# EAGLE design vacuum-controller-rev-a (EAGLE 7.3.0)
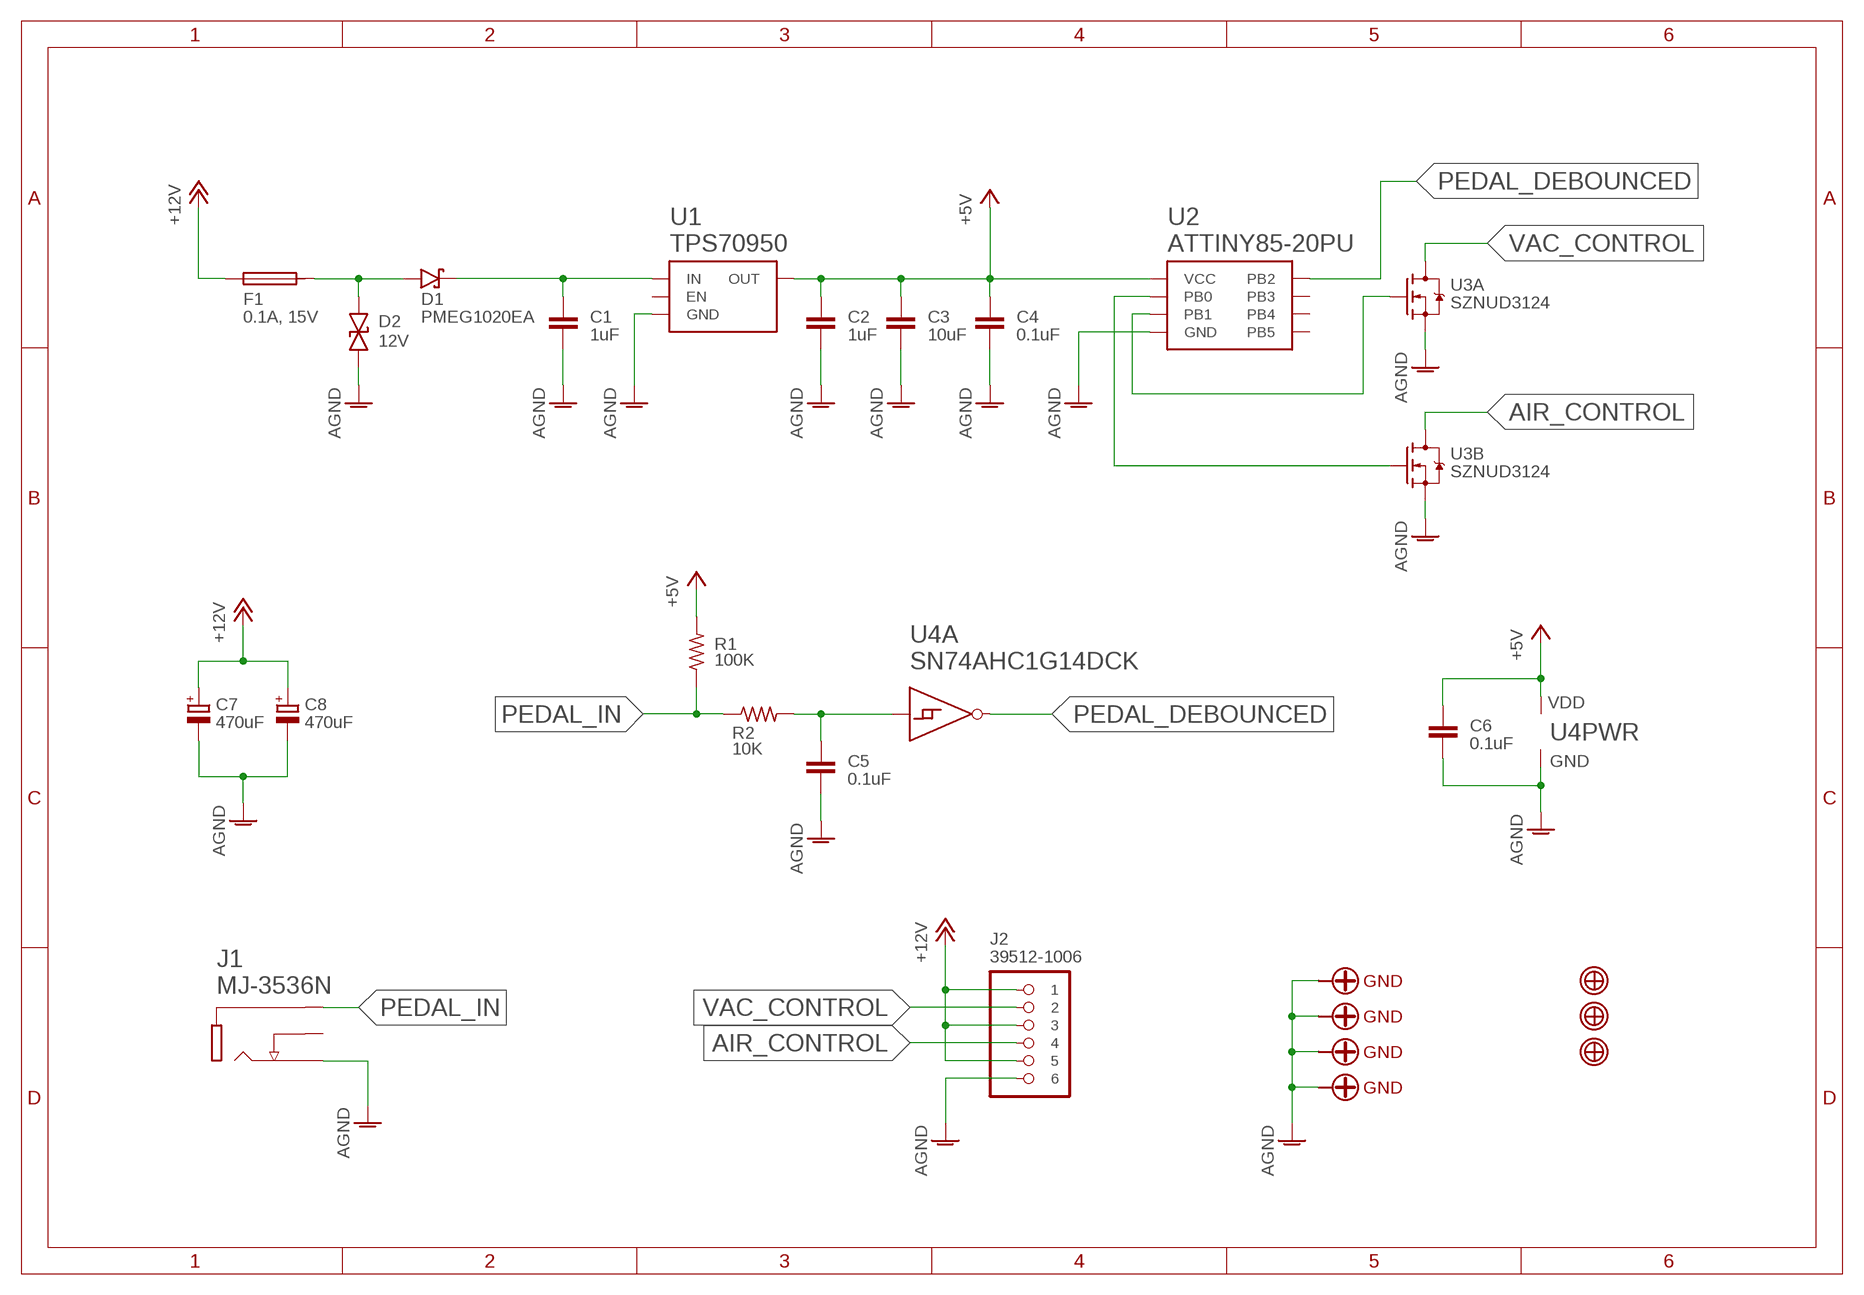
[diagram p0: schematic, sheet 1]

## Parts
C1  1uF  CAPACITOR-0603  [C0603]
C2  1uF  CAPACITOR-0603  [C0603]
C3  10uF  CAPACITOR-0805  [C0805]
C4  0.1uF  CAPACITOR-0402  [C0402]
C5  0.1uF  CAPACITOR-0402  [C0402]
C6  0.1uF  CAPACITOR-0402  [C0402]
C7  470uF  CAPACITOR-POLARIZED-RADIAL-D8-P3.5-PD0.5  [RADIAL-D8-P3.5-PD0.5]
C8  470uF  CAPACITOR-POLARIZED-RADIAL-D8-P3.5-PD0.5  [RADIAL-D8-P3.5-PD0.5]
D1  PMEG1020EA  [SOD323-R]
D2  12V  SUPPRESSOR-DUAL-SMA  [SMA]
F1  0.1A, 15V  FUSE-HORIZONTAL-0805  [C0805]
J1  MJ-3536N  [MJ-3536N]
J2  39512-1006  [39512-1006]
R1  100K  RESISTOR-0402  [R0402]
R2  10K  RESISTOR-HORIZONTAL-0402  [R0402]
U1  TPS70950  TPS709  [R-PDSO-G5-DBV]
U2  ATTINY85-20PU  [PDIP-8]
U3  SZNUD3124  [SOT-457]
U4  SN74AHC1G14DCK  [R-PDSO-G5-DCK]
U$1  SCREW-THRU-GND-#4  [SCREW-THRU-GND-#4]
U$2  SCREW-THRU-GND-#4  [SCREW-THRU-GND-#4]
U$3  SCREW-THRU-GND-#4  [SCREW-THRU-GND-#4]
U$4  SCREW-THRU-GND-#4  [SCREW-THRU-GND-#4]
U$5  FIDUCIAL-1MM  [FIDUCIAL_1MM]
U$6  FIDUCIAL-1MM  [FIDUCIAL_1MM]
U$7  FIDUCIAL-1MM  [FIDUCIAL_1MM]

## Nets
+5V: C2.1 C3.1 C4.1 C6.1 R1.2 U1.5(OUT) U2.P$8(VCC) U4.5(PWR:VDD)
+12V: C7.+ C8.+ F1.1 J2.P$1 J2.P$3 J2.P$5
AGND: C1.2 C2.2 C3.2 C4.2 C5.2 C6.2 C7.- C8.- D2.A J1.P$2 J2.P$6 U1.2(GND) U2.P$4(GND) U3.1(A:S) U3.4(B:S) U4.3(PWR:GND) U$1.P$1(GND) U$1.P$2(GND) U$1.P$3(GND) U$1.P$4(GND) U$1.P$5(GND) U$1.P$6(GND) U$1.P$7(GND) U$1.P$8(GND) U$1.P$9(GND) U$2.P$1(GND) U$2.P$2(GND) U$2.P$3(GND) U$2.P$4(GND) U$2.P$5(GND) U$2.P$6(GND) U$2.P$7(GND) U$2.P$8(GND) U$2.P$9(GND) U$3.P$1(GND) U$3.P$2(GND) U$3.P$3(GND) U$3.P$4(GND) U$3.P$5(GND) U$3.P$6(GND) U$3.P$7(GND) U$3.P$8(GND) U$3.P$9(GND) U$4.P$1(GND) U$4.P$2(GND) U$4.P$3(GND) U$4.P$4(GND) U$4.P$5(GND) U$4.P$6(GND) U$4.P$7(GND) U$4.P$8(GND) U$4.P$9(GND)
AIR_CONTROL: J2.P$4 U3.3(B:D)
N$1: C1.1 D1.C U1.1(IN)
N$2: D1.A D2.C F1.2
N$3: C5.1 R2.2 U4.2(A:A)
N$4: U2.P$6(PB1) U3.2(A:G)
N$6: U2.P$5(PB0) U3.5(B:G)
PEDAL_DEBOUNCED: U2.P$7(PB2) U4.4(A:Y)
PEDAL_IN: J1.P$1 R1.1 R2.1
VAC_CONTROL: J2.P$2 U3.6(A:D)
Unconnected: J1.P$3 U1.3(EN) U2.P$1(PB5) U2.P$2(PB3) U2.P$3(PB4)

## Library data of the parts
C1 C2 = passives:CAPACITOR: Capacitor; PN: GRM188R61E105KA12D
C3 = passives:CAPACITOR: Capacitor; PN: GRM21BR61A106KE19L
C4-C6 = passives:CAPACITOR: Capacitor; PN: GRM155R71H104KE14D
C7 = passives:CAPACITOR-POLARIZED: POLARIZED CAPACITOR, European symbol; PN: 860020474014
C8 = passives:CAPACITOR-POLARIZED: POLARIZED CAPACITOR, European symbol
D1 = nxp:PMEG1020EA: 2A ultra low Vf MEGA Schottky barrier rectiﬁer Planar Maximum Efﬁciency General Application (MEGA) Schottky barrier rectiﬁer with an integrated guard ring for stress protection, encapsulated in SOD323 (SC-76) very small Surface-Mounted Device (SMD) plastic package.; PN: PMEG1020EA,115
D2 = diodes:SUPPRESSOR-DUAL-; PN: SMAJ12CA-13-F
F1 = passives:FUSE-HORIZONTAL; PN: 0ZCK0010FF2G
J1 = cui:MJ-3536N; PN: MJ-3536N
J2 = molex:39512-1006: 3.81mm Pitch Eurostyle™ Horizontal PCB Header, 6 Circuits; MATES: 39510-0006; PN: 39512-1006
R1 = passives:RESISTOR; PN: RC0402FR-07100KL
R2 = passives:RESISTOR-HORIZONTAL; PN: RC0402FR-0710KL
U1 = texas-instruments:TPS709: 150-mA, 30-V, 1-µA Iq Voltage Regulators with Enable; PN: TPS70950DBVR
U2 = atmel:ATTINY: Atmel 8-bit AVR Microcontroller with 2/4/8K Bytes In-System Programmable Flash; PN: ATtiny85-20SU
U3 = on-semiconductor:SZNUD3124: Automotive Inductive Load Driver (two channel) This micro−integrated part provides a single component solution to switch inductive loads such as relays, solenoids, and small DC motors without the need of a free−wheeling diode. It accepts logic level inputs, thus allowing it to be driven by a large variety of devices including logic gates, inverters, and microcontrollers.; PN: SZNUD3124DMT1G
U4 = texas-instruments:SN74AHC1G14: Single Schmitt-Trigger Inverter Gate; PN: SN74AHC1G14DCKR
U$1-U$4 = screws:SCREW-THRU-GND; BOM: EXCLUDE
U$5-U$7 = fiducials:FIDUCIAL: Fidicual Mark Used by pick-and-place machines to align and orient boards before loading components.; BOM: EXCLUDE

## Board
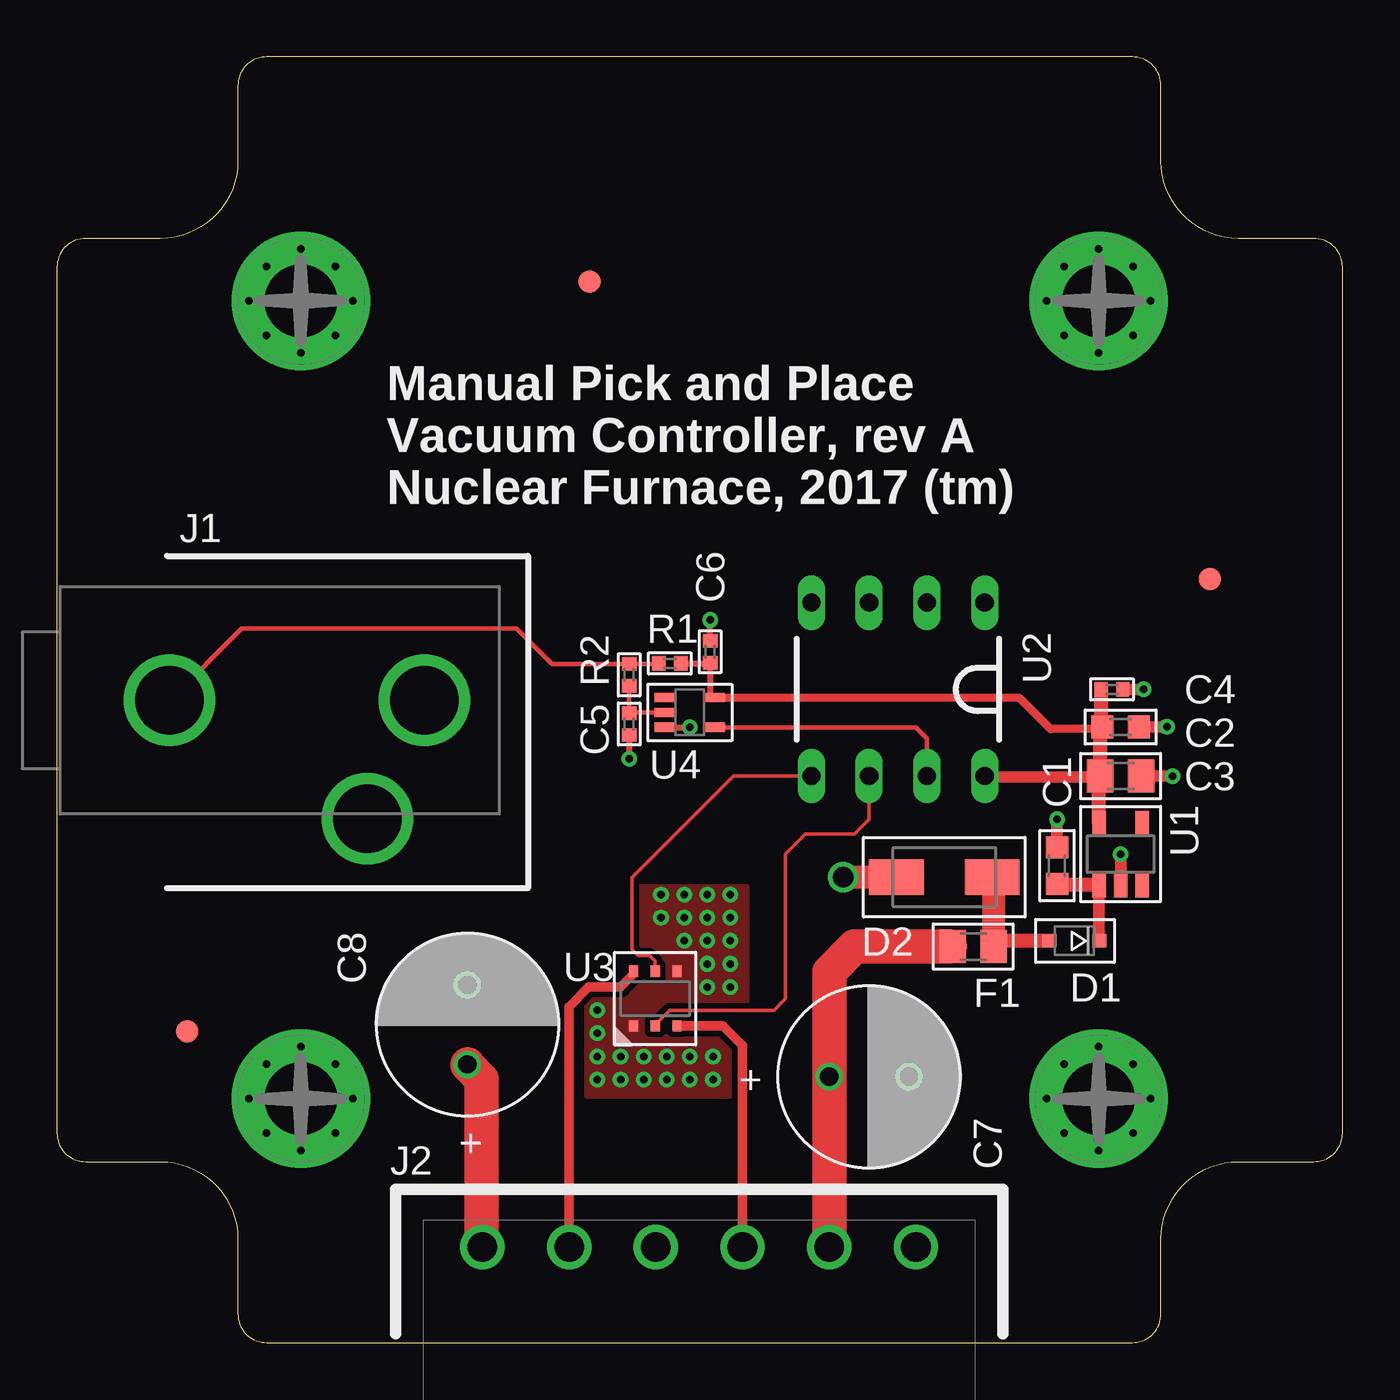
[diagram p1: board, top side]
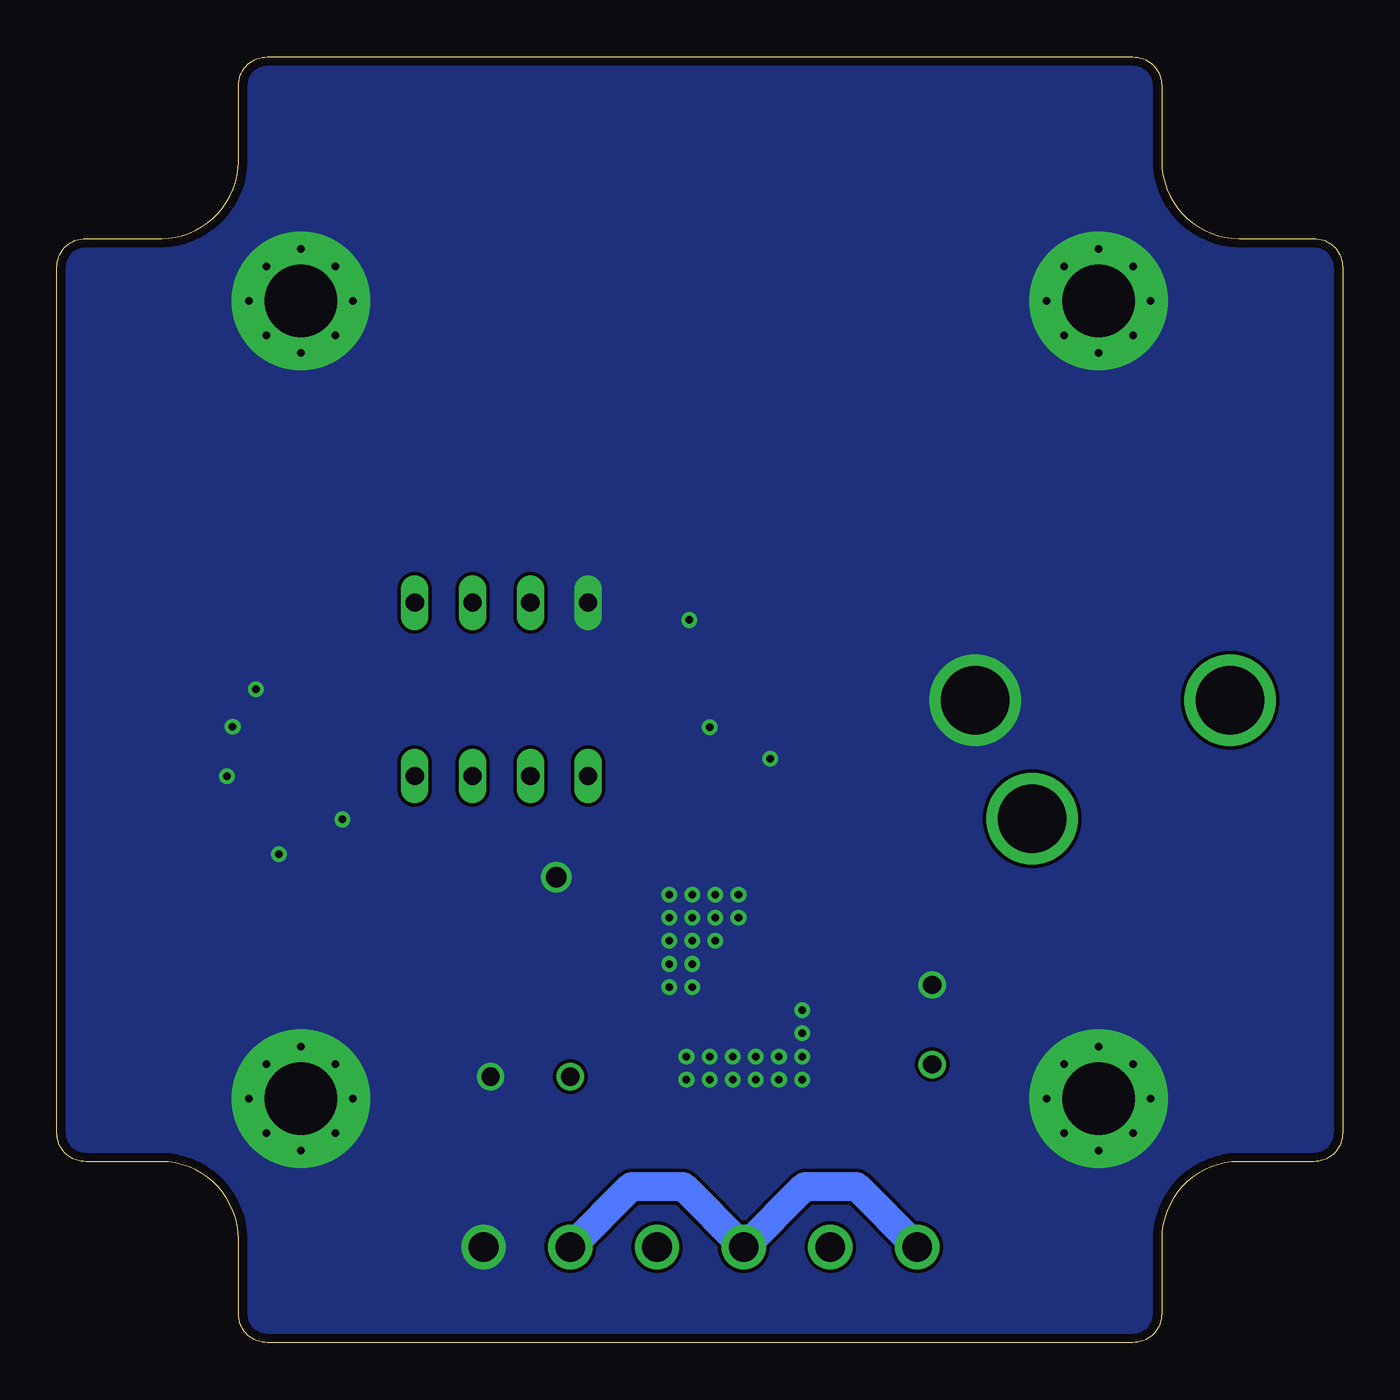
[diagram p2: board, bottom side, seen from below]

Size 56.49 x 56.49 mm. Coordinates in mm from the lower left corner, seen from the top.
Outline: 7.95,4.55 7.95,1.27 arc90 9.22,0 47.24,0 arc90 48.51,1.27 48.51,4.55 arc-90 51.92,7.95 55.22,7.95 arc90 56.49,9.22 56.49,47.24 arc90 55.22,48.51 51.92,48.51 arc-90 48.51,51.92 48.51,55.22 arc90 47.24,56.49 9.22,56.49 arc90 7.95,55.22 7.95,51.92 arc-90 4.55,48.51 1.27,48.51 arc90 0,47.24 0,9.22 arc90 1.27,7.95 4.55,7.95 arc-90 7.95,4.55
Copper layers (1*16): Top 0.035559375mm / dielectric 60mil / Bottom 0.035559375mm
Design rules "OSHPark-2Layer": minimum track width 6mil, minimum drill 13mil, track to track 6mil, track to pad 6mil, pad to pad 6mil, via to via 6mil, smd to smd 6mil, copper to edge 15mil, drill to drill 6mil, minimum pad ring 7mil, minimum via ring 7mil, stop-mask expansion 3mil, vias tented up to drill 14mil, thermal gap 10mil

### Footprints (pad centres in the part's own frame; a part is rotated, then mirrored left to right if it is on the bottom)
C0603 = smd 0.95 x 1: 1 -0.8,0; 2 0.8,0
C0805 = smd 1.15 x 1.45: 1 -0.9,0; 2 0.9,0
C0402 = smd 0.59 x 0.64: 1 -0.48,0; 2 0.48,0
RADIAL-D8-P3.5-PD0.5 = drill 0.8: + 1.75,0; - -1.75,0
SOD323-R = smd 0.6 x 0.6: A 1.1,0; C -1.1,0
SMA = smd 2.4 x 1.55: A 2.1,0; C -2.1,0
MJ-3536N = drill 3: P$1 -5.6,0; P$2 5.6,0; P$3 3.1,-5.2
39512-1006 = drill 1.3: P$1 -9.525,0; P$2 -5.715,0; P$3 -1.905,0; P$4 1.905,0; P$5 5.715,0; P$6 9.525,0
R0402 = smd 0.59 x 0.64: 1 -0.48,0; 2 0.48,0
R-PDSO-G5-DBV = smd 0.6 x 1.1: 1 -0.95,-1.35; 2 0,-1.35; 3 0.95,-1.35; 4 0.95,1.35; 5 -0.95,1.35
PDIP-8 = drill 0.8 long: P$1 -3.81,-3.81; P$2 -1.27,-3.81; P$3 1.27,-3.81; P$4 3.81,-3.81; P$5 3.81,3.81; P$6 1.27,3.81; P$7 -1.27,3.81; P$8 -3.81,3.81
SOT-457 = smd 0.5 x 0.4: 1 -1.2,0.95; 2 -1.2,0; 3 -1.2,-0.95; 4 1.2,-0.95; 5 1.2,0; 6 1.2,0.95
R-PDSO-G5-DCK = smd 0.4 x 0.9: 1 -0.65,-1.1; 2 0,-1.1; 3 0.65,-1.1; 4 0.65,1.1; 5 -0.65,1.1
SCREW-THRU-GND-#4 = drill 0.33: P$1 0,2.286; P$2 0,-2.286; P$3 -2.286,0; P$4 2.286,0; P$5 1.524,1.524; P$6 -1.524,1.524; P$7 -1.524,-1.524; P$8 1.524,-1.524 | drill 3.175 pad 6.096: P$9 0,0
FIDUCIAL_1MM = smd 1 x 1: 1 0,0

### Placement (x,y rotation side)
C1  43.94,20.95 90 top
C2  46.74,27.05 0 top
C3  46.74,24.89 0 top
C4  46.35,28.7 0 top
C5  25.15,27.18 270 top
C6  28.7,30.35 90 top
C7  35.69,11.68 180 top
C8  18.03,13.97 270 top
D1  44.7,17.65 180 top
D2  38.99,20.45 180 top
F1  40.26,17.4 0 top
J1  10.54,28.22 0 top
J2  28.22,4.19 0 top
R1  26.92,29.84 0 top
R2  25.15,29.34 270 top
U1  46.74,21.46 0 top
U2  36.96,28.7 180 top
U3  26.29,15.11 90 top
U4  27.81,27.69 270 top
U$1  45.77,10.72 0 top
U$2  10.72,10.72 0 top
U$3  45.77,45.77 0 top
U$4  10.72,45.77 0 top
U$5  23.39,46.61 0 top
U$6  5.71,13.67 0 top
U$7  50.65,33.55 0 top

### Tracks (layer width: path | path; a pad name or v marks a point on that pad's centre or on a via)
+5V
  Top 0.254: R1.2 28.67,29.84 | 28.67,29.84 C6.1 | 28.67,29.84 28.7,29.84 28.7,28.34 U4.5
  Top 0.356: U4.5 42.28,28.34 43.66,26.95 45.84,26.95
  Top 0.508: C3.1 45.79,24.84 40.82,24.84 U2.P$8 | 45.84,26.95 C2.1 45.88,27.11
  Top 0.61: U1.5 45.79,24.84 | C3.1 45.84,26.95 | C4.1 45.88,27.11
+12V
  Top 0.152: C7.+ 33.94,12.06
  Top 0.203: 33.94,12.06 33.93,12.06
  Top 1.016: F1.1 39.24,17.4
  Top 1.524: J2.P$5 33.93,12.06 33.93,16.28 35.05,17.4 39.24,17.4 | C8.+ 18.03,12.19 18.67,11.56 18.67,4.22 J2.P$1
  Bottom 1.27: J2.P$5 33.91,4.19 31.24,6.86 28.98,6.86 J2.P$3 26.29,4.19 23.62,6.86 21.36,6.86 J2.P$1
AGND  (via drill 0.33, 0.89)
  Top 0.254: C5.2 v25.15,25.65 | C6.2 v28.7,31.75 | U4.3 v27.81,27.04
  Top 0.508: U1.2 v46.74,21.46 | C1.2 v43.94,22.99 | C3.2 v49.02,24.89 | C2.2 v48.77,27.05 | C4.2 v47.75,28.7
  Top 1.016: D2.A v34.54,20.45
  other vias: 23.75,14.61 23.75,13.59 23.75,12.57 24.77,12.57 25.78,12.57 26.8,12.57 28.83,12.57 28.57,17.65 28.57,16.64 27.56,17.65 27.56,19.68 28.57,18.67 27.56,18.67 26.54,18.67 27.81,12.57 29.59,16.64 29.59,17.65 29.59,18.67 23.75,11.56 24.77,11.56 25.78,11.56 26.8,11.56 27.81,11.56 28.83,11.56 29.59,19.68 28.57,19.68 28.57,15.62 29.59,15.62 26.54,19.68
  pour Bottom (no thermals): 0,56.46 56.46,56.46 56.46,0 1.27,0 arc-90 0,1.27
  pour Top (isolate 0.254, no thermals): 30.35,20.07 23.24,20.07 23.24,10.79 30.35,10.79
AIR_CONTROL
  Top 0.406: U3.3 29.27,13.91 30.12,13.06 J2.P$4
N$1
  Top 0.152: C1.1 43.94,20.11
  Top 0.508: U1.1 45.79,17.67 D1.C
  Top 0.61: U1.1 43.94,20.11
N$2
  Top 0.61: D1.A 41.41,17.65 F1.2
  Top 1.016: F1.2 41.16,20.38 D2.C
N$3
  Top 0.152: 25.17,27.69 C5.1
  Top 0.203: C5.1 R2.2 | 25.17,27.69 U4.2
N$4
  Top 0.152: U2.P$6 35.69,22.99 35.05,22.35 32.89,22.35 32,21.46 32,15.11 31.5,14.61 26.92,14.61 26.29,13.97 U3.2
N$6
  Top 0.152: U3.5 26.29,16.76 26.04,17.02 25.53,17.02 25.27,17.27 25.27,20.45 29.72,24.89 U2.P$5
PEDAL_DEBOUNCED
  Top 0.203: U4.4 37.73,27.04 38.23,26.54 U2.P$7
PEDAL_IN
  Top 0.152: 26.42,29.82 R1.1
  Top 0.203: 26.42,29.82 R2.1 21.75,29.82 20.19,31.37 8.13,31.37 4.98,28.22 J1.P$1
VAC_CONTROL
  Top 0.406: U3.6 25.34,16.2 24.77,15.62 23.37,15.62 22.5,14.76 J2.P$2

### Text on the board
tNames: Manual Pick and Place / Vacuum Controller, rev A / Nuclear Furnace, 2017 (tm)